# EAGLE design ElectricalLoads (EAGLE 9.5.1)
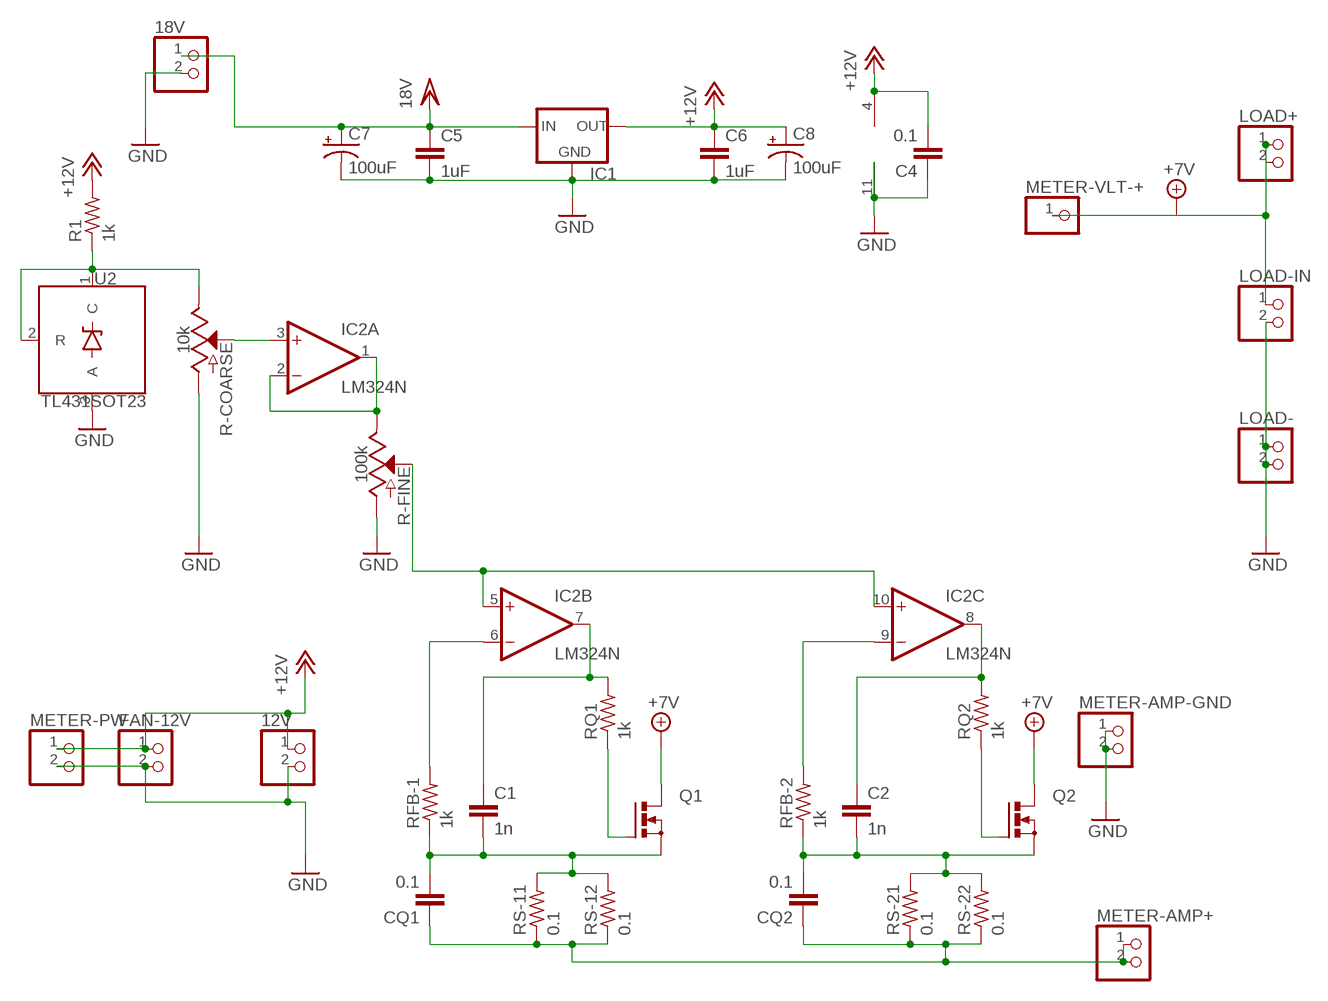
[diagram p0: schematic, sheet 1]

## Parts
12V  PINHD-1X2  [1X02]
18V  PINHD-1X2  [1X02]
C1  1n  CAP-0805  [0805]
C2  1n  CAP-0805  [0805]
C4  0.1  CAP-0805  [0805]
C5  1uF  10UF-1210-50V-20%  [1210]
C6  1uF  10UF-1210-50V-20%  [1210]
C7  100uF  100UF-POLAR-25V-20%(ELEC)  [PANASONIC_D]
C8  100uF  100UF-POLAR-25V-20%(ELEC)  [PANASONIC_D]
CQ1  0.1  CAP-0805  [0805]
CQ2  0.1  CAP-0805  [0805]
FAN-12V  PINHD-1X2  [1X02]
IC1  78XXS  [78XXS]
IC2  LM324N  [DIL14]
LOAD+  PINHD-1X2  [1X02]
LOAD-  PINHD-1X2  [1X02]
LOAD-IN  PINHD-1X2  [1X02]
METER-AMP+  PINHD-1X2  [1X02]
METER-AMP-GND  PINHD-1X2  [1X02]
METER-PW  PINHD-1X2  [1X02]
METER-VLT-+  PINHD-1X1  [1X01]
Q1  PMOSFET_NTO220BH  [TO220BH]
Q2  PMOSFET_NTO220BH  [TO220BH]
R1  1k  R-US_M0805  [M0805]
R-COARSE  10k  POTENTIOMETER-PTH-9MM-1/20W-20%  [POT-PTH-ALPS]
R-FINE  100k  POTENTIOMETER-PTH-9MM-1/20W-20%  [POT-PTH-ALPS]
RFB-1  1k  R-US_M0805  [M0805]
RFB-2  1k  R-US_M0805  [M0805]
RQ1  1k  R-US_M0805  [M0805]
RQ2  1k  R-US_M0805  [M0805]
RS-11  0.1  R-US_R2512  [R2512]
RS-12  0.1  R-US_R2512  [R2512]
RS-21  0.1  R-US_R2512  [R2512]
RS-22  0.1  R-US_R2512  [R2512]
U2  TL431SOT23  [SOT23-3]

## Nets
+7V: LOAD+.1 LOAD+.2 LOAD-IN.1 METER-VLT-+.1 Q1.D Q2.D
+12V: 12V.1 C4.2 C6.1 C8.+ FAN-12V.1 IC1.OUT IC2.4(P:V+) METER-PW.1 R1.2
GND: 12V.2 18V.2 C4.1 C5.2 C6.2 C7.- C8.- FAN-12V.2 IC1.GND IC2.11(P:V-) LOAD-.1 LOAD-.2 LOAD-IN.2 METER-AMP-GND.1 METER-AMP-GND.2 METER-PW.2 R-COARSE.P$3(A) R-FINE.P$3(A) U2.3(A)
N$1: C1.2 CQ1.2 Q1.S RFB-1.1 RS-11.2 RS-12.2
N$2: Q1.G RQ1.1
N$3: IC2.3(A:+IN) R-COARSE.P$2(S)
N$4: C1.1 IC2.7(B:OUT) RQ1.2
N$5: IC2.6(B:-IN) RFB-1.2
N$6: C2.2 CQ2.2 Q2.S RFB-2.1 RS-21.2 RS-22.2
N$7: Q2.G RQ2.1
N$9: C2.1 IC2.8(C:OUT) RQ2.2
N$10: IC2.9(C:-IN) RFB-2.2
N$13: R1.1 R-COARSE.P$1(E) U2.1(C) U2.2(R)
N$16: CQ1.1 CQ2.1 METER-AMP+.1 METER-AMP+.2 RS-11.1 RS-12.1 RS-21.1 RS-22.1
N$17: IC2.5(B:+IN) IC2.10(C:+IN) R-FINE.P$2(S)
N$18: IC2.1(A:OUT) IC2.2(A:-IN) R-FINE.P$1(E)
VCC/2: 18V.1 C5.1 C7.+ IC1.IN ; supply symbol labelled 18V
Unconnected: IC2.12(D:+IN) IC2.13(D:-IN) IC2.14(D:OUT)

## Library data of the parts
12V 18V FAN-12V LOAD+ LOAD- LOAD-IN METER-AMP+ METER-AMP-GND METER-PW = pinhead:PINHD-1X2: PIN HEADER
C1 C2 C4 CQ1 CQ2 = SparkFun-Capacitors:CAP
C5 C6 = SparkFun-Capacitors:10UF: 10.0µF ceramic capacitors A capacitor is a passive two-terminal electrical component used to store electrical energy temporarily in an electric field.; PROD_ID: CAP-09824; VALUE: 10uF
C7 C8 = SparkFun-Capacitors:100UF-POLAR: 100µF polarized capacitors A capacitor is a passive two-terminal electrical component used to store electrical energy temporarily in an electric field.; PROD_ID: CAP-12547
IC1 = v-reg:78XXS: VOLTAGE REGULATOR
IC2 = linear:LM324: OP AMP
METER-VLT-+ = pinhead:PINHD-1X1: PIN HEADER
Q1 Q2 = transistor-power:PMOSFET_N: Power MOSFET N-Channel
R1 RFB-1 RFB-2 RQ1 RQ2 RS-11 RS-12 RS-21 RS-22 = rcl:R-US_: RESISTOR, American symbol; SPICEPREFIX: R
R-COARSE = SparkFun-Resistors:POTENTIOMETER: Potentiometer (Pot) Three-terminal potentiometers, with an adjustable wiper and two adjustable resistors. A pot can be used to create a configurable voltage divider, or as a variable resistor. Variants ALPS_POT and ALPS_POT_KIT - PTH, breadboard compatible, 9mm square pots Rotary Potentiometer - Linear (10k ohm) <https://www.sparkfun.com/products/9288> (COM-09288) The KIT variant exposes copper on only one side of the PTH pad, so the part can only be assembled on one side of the PCB. Useful for beginner soldering kits.; PROD_ID: RES-09177; SF_SKU: COM-09288
R-FINE = SparkFun-Resistors:POTENTIOMETER: Potentiometer (Pot) Three-terminal potentiometers, with an adjustable wiper and two adjustable resistors. A pot can be used to create a configurable voltage divider, or as a variable resistor. Variants ALPS_POT and ALPS_POT_KIT - PTH, breadboard compatible, 9mm square pots Rotary Potentiometer - Linear (10k ohm) <https://www.sparkfun.com/products/9288> (COM-09288) The KIT variant exposes copper on only one side of the PTH pad, so the part can only be assembled on one side of the PCB. Useful for beginner soldering kits.; PROD_ID: RES-09177; SF_SKU: COM-09288; VALUE: 10k
U2 = SparkFun-DiscreteSemi:TL431: TL431- Voltage Reference Precision Programmable Shunt Regulator Diode Datasheet <https://cdn.sparkfun.com/datasheets/Components/General%20IC/TL431-D.pdf> SparkFun Products: TL431-Voltage Reference PTH <https://www.sparkfun.com/products/11078> SparkFun Uh-Oh Battery Level Indicator <https://www.sparkfun.com/products/11087>

## Board
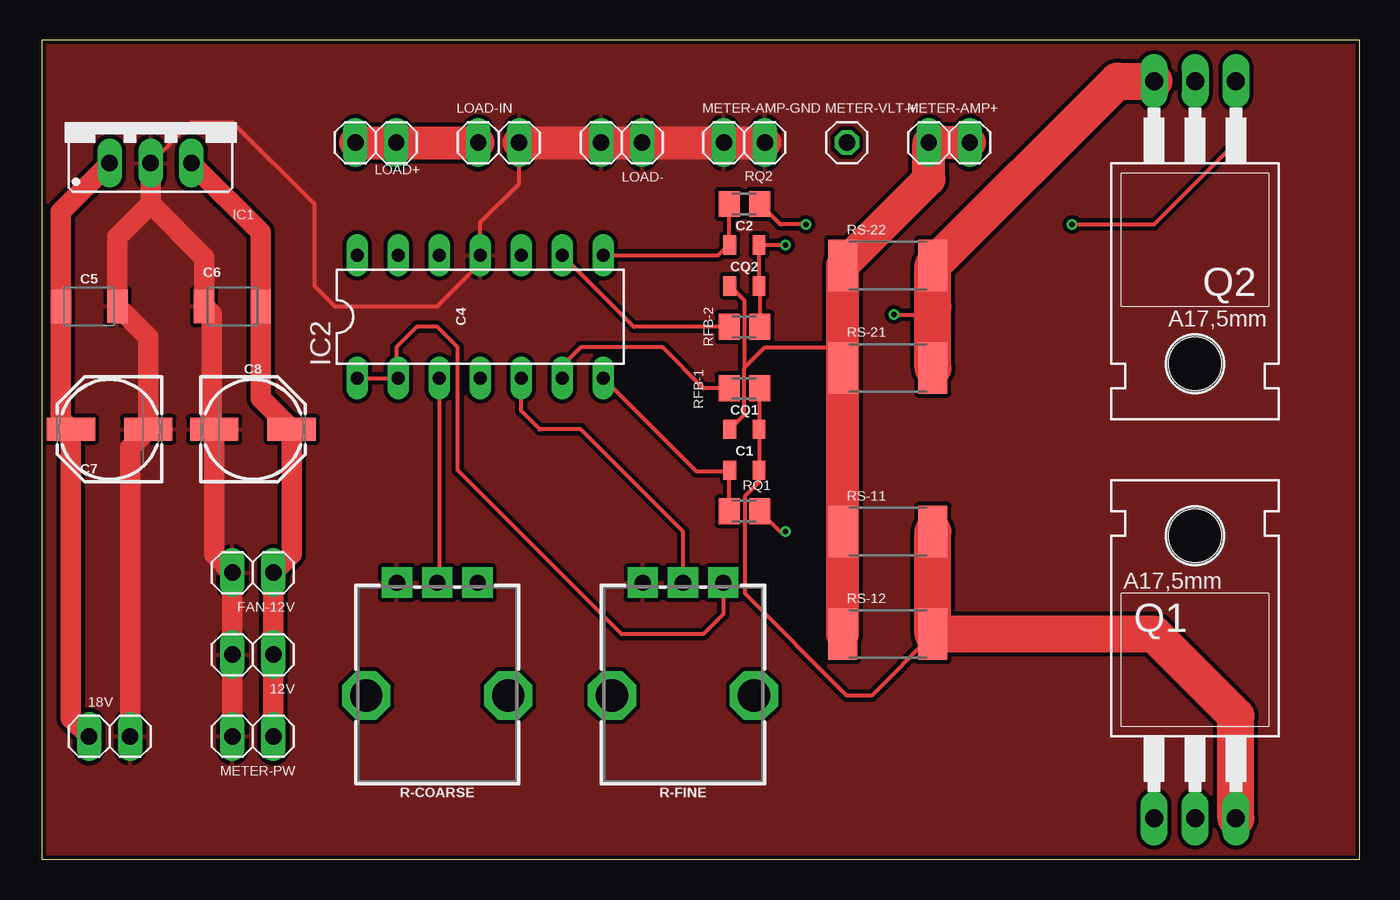
[diagram p1: board, top side]
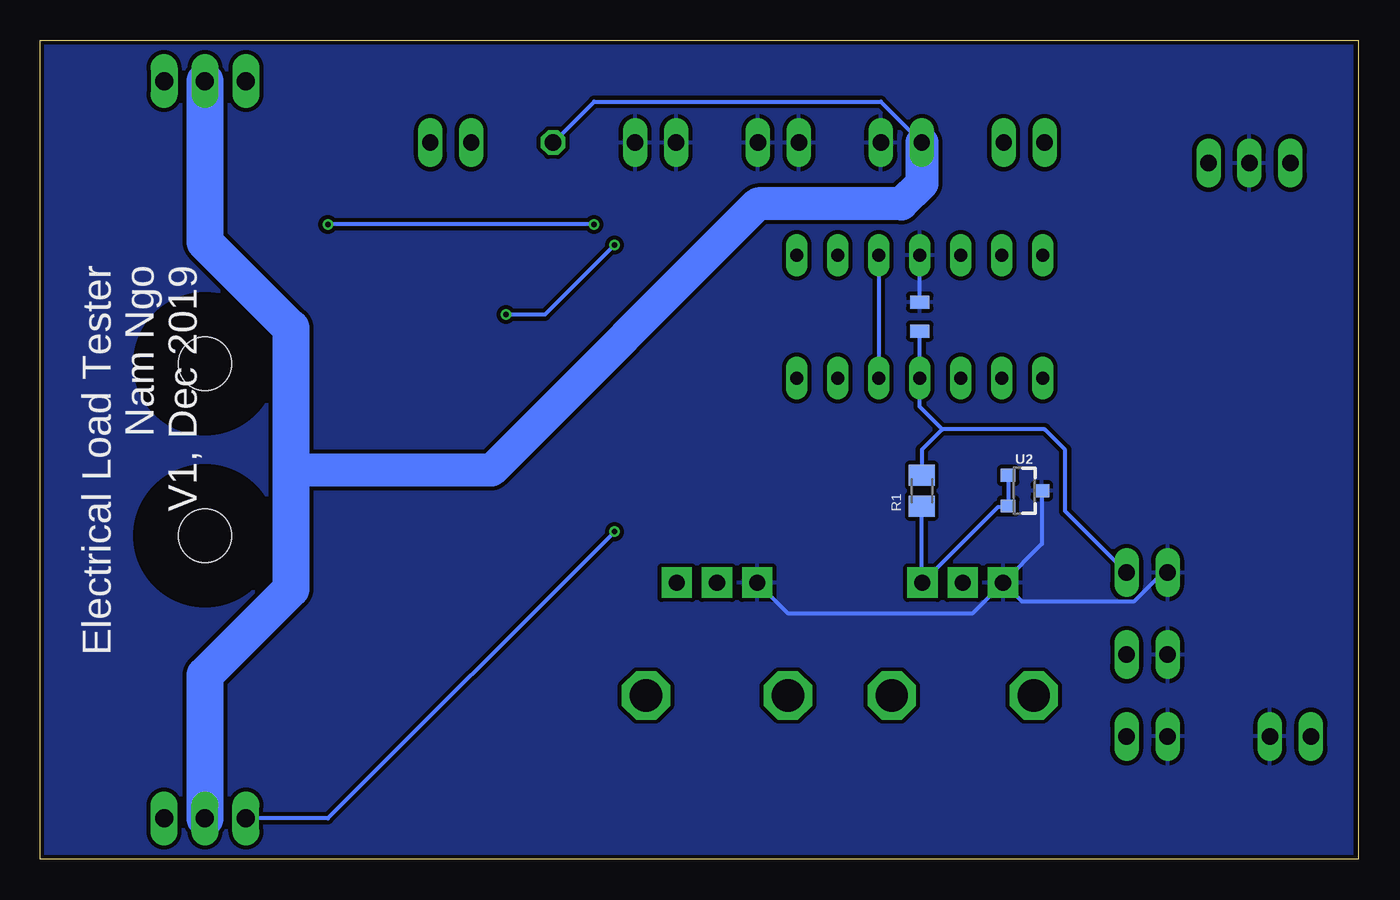
[diagram p2: board, bottom side, seen from below]

Size 81.71 x 50.79 mm. Coordinates in mm from the lower left corner, seen from the top.
Outline: 0,0 81.71,0 81.71,50.79 0,50.79 0,0
Copper layers (1*16): Top 0.035mm / dielectric 1.5mm / Bottom 0.035mm
Design rules "dirt_cheap_dirty_boards.v1.1": minimum track width 6mil, minimum drill 12mil, track to track 6mil, track to pad 6mil, pad to pad 6mil, via to via 6mil, smd to smd 0mil, copper to edge 10mil, drill to drill 10mil, minimum pad ring 10mil, minimum via ring 6mil, stop-mask expansion 2mil, vias tented up to drill 25mil, thermal gap 10mil

### Footprints (pad centres in the part's own frame; a part is rotated, then mirrored left to right if it is on the bottom)
1X02 = drill 1.016 long: 1 -1.27,0; 2 1.27,0
0805 = smd 0.8 x 1.2: 1 -0.9,0; 2 0.9,0
1210 = smd 1.27 x 2.06: 1 -1.755,0; 2 1.755,0
PANASONIC_D = smd 3 x 1.4: + 2.4,0; - -2.4,0
78XXS = drill 1.016 long: GND 0,-2.54; IN -2.54,-2.54; OUT 2.54,-2.54
DIL14 = drill 0.813 long: 1 -7.62,-3.81; 2 -5.08,-3.81; 3 -2.54,-3.81; 4 0,-3.81; 5 2.54,-3.81; 6 5.08,-3.81; 7 7.62,-3.81; 8 7.62,3.81; 9 5.08,3.81; 10 2.54,3.81; 11 0,3.81; 12 -2.54,3.81; 13 -5.08,3.81; 14 -7.62,3.81
1X01 = drill 1.016 octagon: 1 0,0
TO220BH = drill 1.118 long: D 0,-6.35; G -2.54,-6.35; S 2.54,-6.35 | hole 3.302: 0,11.176
M0805 = smd 1.3 x 1.6: 1 -0.95,0; 2 0.95,0
POT-PTH-ALPS = drill 1 pad 1.88 square: P$1 7,-2.5; P$2 7,0; P$3 7,2.5 | drill 2 octagon: P$4 0,-4.4; P$5 0,4.4
R2512 = smd 1.8 x 3.2: 1 -2.8,0; 2 2.8,0
SOT23-3 = smd 0.8 x 0.9: 1 -0.95,-1; 2 0.95,-1; 3 0,1.1

### Placement (x,y rotation side)
12V  13.08,12.7 180 top
18V  4.19,7.62 0 top
C1  43.56,24.13 0 top
C2  43.56,38.1 0 top
C4  27.18,33.65 270 bottom
C5  2.92,34.29 0 top
C6  11.81,34.29 180 top
C7  4.19,26.67 180 top
C8  13.08,26.67 0 top
CQ1  43.56,26.67 0 top
CQ2  43.56,35.56 0 top
FAN-12V  13.08,17.78 180 top
IC1  6.73,45.72 0 top
IC2  27.18,33.65 0 top
LOAD+  20.7,44.45 0 top
LOAD-  35.94,44.45 180 top
LOAD-IN  28.32,44.45 0 top
METER-AMP+  56.26,44.45 0 top
METER-AMP-GND  43.56,44.45 0 top
METER-PW  13.08,7.62 180 top
METER-VLT-+  49.91,44.45 0 top
Q1  71.5,8.89 0 top
Q2  71.5,41.91 180 top
R1  27.05,22.86 90 bottom
R-COARSE  24.51,10.16 90 top
R-FINE  39.75,10.16 90 top
RFB-1  43.56,29.21 180 top
RFB-2  43.56,33.02 180 top
RQ1  43.56,21.59 180 top
RQ2  43.56,40.64 180 top
RS-11  52.45,20.32 0 top
RS-12  52.45,13.97 0 top
RS-21  52.45,30.48 0 top
RS-22  52.45,36.83 0 top
U2  20.7,22.86 270 bottom

### Tracks (layer width: path | path; a pad name or v marks a point on that pad's centre or on a via)
+7V
  Top 2.032: LOAD+.1 LOAD+.2 LOAD-IN.1
  Bottom 0.254: METER-VLT-+.1 47.37,46.99 29.59,46.99 LOAD-IN.1
  Bottom 2.032: LOAD-IN.1 27.05,41.91 28.32,40.64 37.21,40.64 53.72,24.13 66.17,24.13
  Bottom 2.286: Q2.D 71.5,38.28 66.17,32.94 66.17,24.13 66.17,16.76 71.5,11.43 Q1.D
+12V
  Top 1.27: IC1.OUT 13.57,38.88 C6.1 13.57,28.58 C8.+ 15.48,18.91 FAN-12V.1 12V.1 METER-PW.1
  Bottom 0.254: FAN-12V.1 18.16,21.59 18.16,25.4 19.43,26.67 25.78,26.67 | 25.78,26.67 27.05,25.4 R1.2 | 25.78,26.67 27.18,28.07 IC2.4 C4.2
GND
  Top 0.254: IC1.GND 9.27,45.72 11.81,45.72 16.89,40.64 16.89,35.56 18.16,34.29 24.51,34.29 27.18,36.96 IC2.11 27.18,39.5 29.59,41.91 LOAD-IN.2
  Top 1.27: 18V.2 5.46,25.54 C7.- 6.59,32.37 C5.2 4.68,38.59 6.73,40.64 | 6.73,40.64 IC1.GND | 6.73,40.64 10.06,37.31 C6.2 10.54,33.8 10.54,26.67 C8.- 10.68,18.91 FAN-12V.2 12V.2 METER-PW.2
  Top 2.032: LOAD-IN.2 LOAD-.2 LOAD-.1 METER-AMP-GND.1 METER-AMP-GND.2
  Bottom 0.254: C4.1 IC2.11 | U2.3 19.6,19.57 R-COARSE.P$3 | FAN-12V.2 12.12,17.78 13.92,15.98 20.83,15.98 R-COARSE.P$3 | R-COARSE.P$3 23.93,15.24 35.33,15.24 R-FINE.P$3
  pour Bottom (isolate 0.254): 0.38,50.8 81.66,50.8 81.66,0 0.38,0
  pour Top (isolate 0.254): 0.38,50.8 81.66,50.8 81.66,0 0.38,0
N$1
  Top 0.254: RFB-1.1 44.51,26.72 CQ1.2 44.51,26.62 44.51,24.18 C1.2 44.46,23.38 43.58,22.51 43.58,16.49 49.91,10.16 51.44,10.16 RS-12.2
  Top 2.286: Q1.S 74.04,8.89 68.96,13.97 RS-12.2 RS-11.2
N$2  (via drill 0.35)
  Top 0.254: RQ1.1 45.78,20.32 v46.1,20.32
  Bottom 0.254: v46.1,20.32 63.88,2.54 Q1.G
N$3
  Top 0.254: IC2.3 24.64,17.29 R-COARSE.P$2
N$4
  Top 0.254: 42.61,24.08 C1.1 | RQ1.2 42.61,24.08 | IC2.7 40.56,24.08 42.61,24.08
N$5
  Top 0.254: IC2.6 32.26,30.61 33.4,31.75 38.48,31.75 41.02,29.21 RFB-1.2
N$6  (via drill 0.35)
  Top 0.254: RFB-2.1 44.51,35.51 CQ2.2 C2.2 v46.1,38.1 | v52.83,33.78 54.74,33.78 55.25,34.29
  Top 2.286: RS-21.2 55.25,34.29 RS-22.2 66.68,48.26 Q2.S
  Bottom 0.254: v46.1,38.1 50.42,33.78 v52.83,33.78
N$7  (via drill 0.35)
  Top 0.254: v47.37,39.37 45.78,39.37 RQ2.1 | v63.88,39.37 68.96,39.37 74.04,44.45 Q2.G
  Bottom 0.254: v47.37,39.37 v63.88,39.37
N$9
  Top 0.254: IC2.8 41.93,37.46 42.61,38.15 | C2.1 42.61,38.15 | 42.61,38.15 RQ2.2
N$10
  Top 0.254: RFB-2.2 36.7,33.02 IC2.9
N$13
  Bottom 0.254: U2.1 U2.2 21.7,21.86 22.31,21.86 R-COARSE.P$1 27.05,17.2 R1.1
N$16
  Top 0.254: CQ1.1 43.56,27.57 43.56,30.48 | 43.56,30.48 44.83,31.75 49.65,31.75 | CQ2.1 43.56,34.66 43.56,30.48
  Top 2.032: METER-AMP+.2 METER-AMP+.1 54.99,42.17 RS-22.1 49.65,31.75 RS-21.1 RS-11.1 RS-12.1
N$17
  Top 0.254: R-FINE.P$2 39.75,20.32 33.4,26.67 30.86,26.67 29.72,27.81 IC2.5
  Bottom 0.254: IC2.10 IC2.5
N$18
  Top 0.254: IC2.1 21.97,29.84 | 21.97,29.84 IC2.2 | 21.97,29.84 21.97,31.75 23.24,33.02 24.51,33.02 25.78,31.75 25.78,24.13 35.94,13.97 41.02,13.97 42.25,15.2 R-FINE.P$1
VCC/2
  Top 1.27: IC1.IN 1.17,40.15 C5.1 1.17,27.29 C7.+ 1.79,8.75 18V.1

### Text on the board
bPlace: Electrical Load Tester / Nam Ngo / V1, Dec 2019